# EAGLE design Breakout Board for USB microB (EAGLE 6.4)
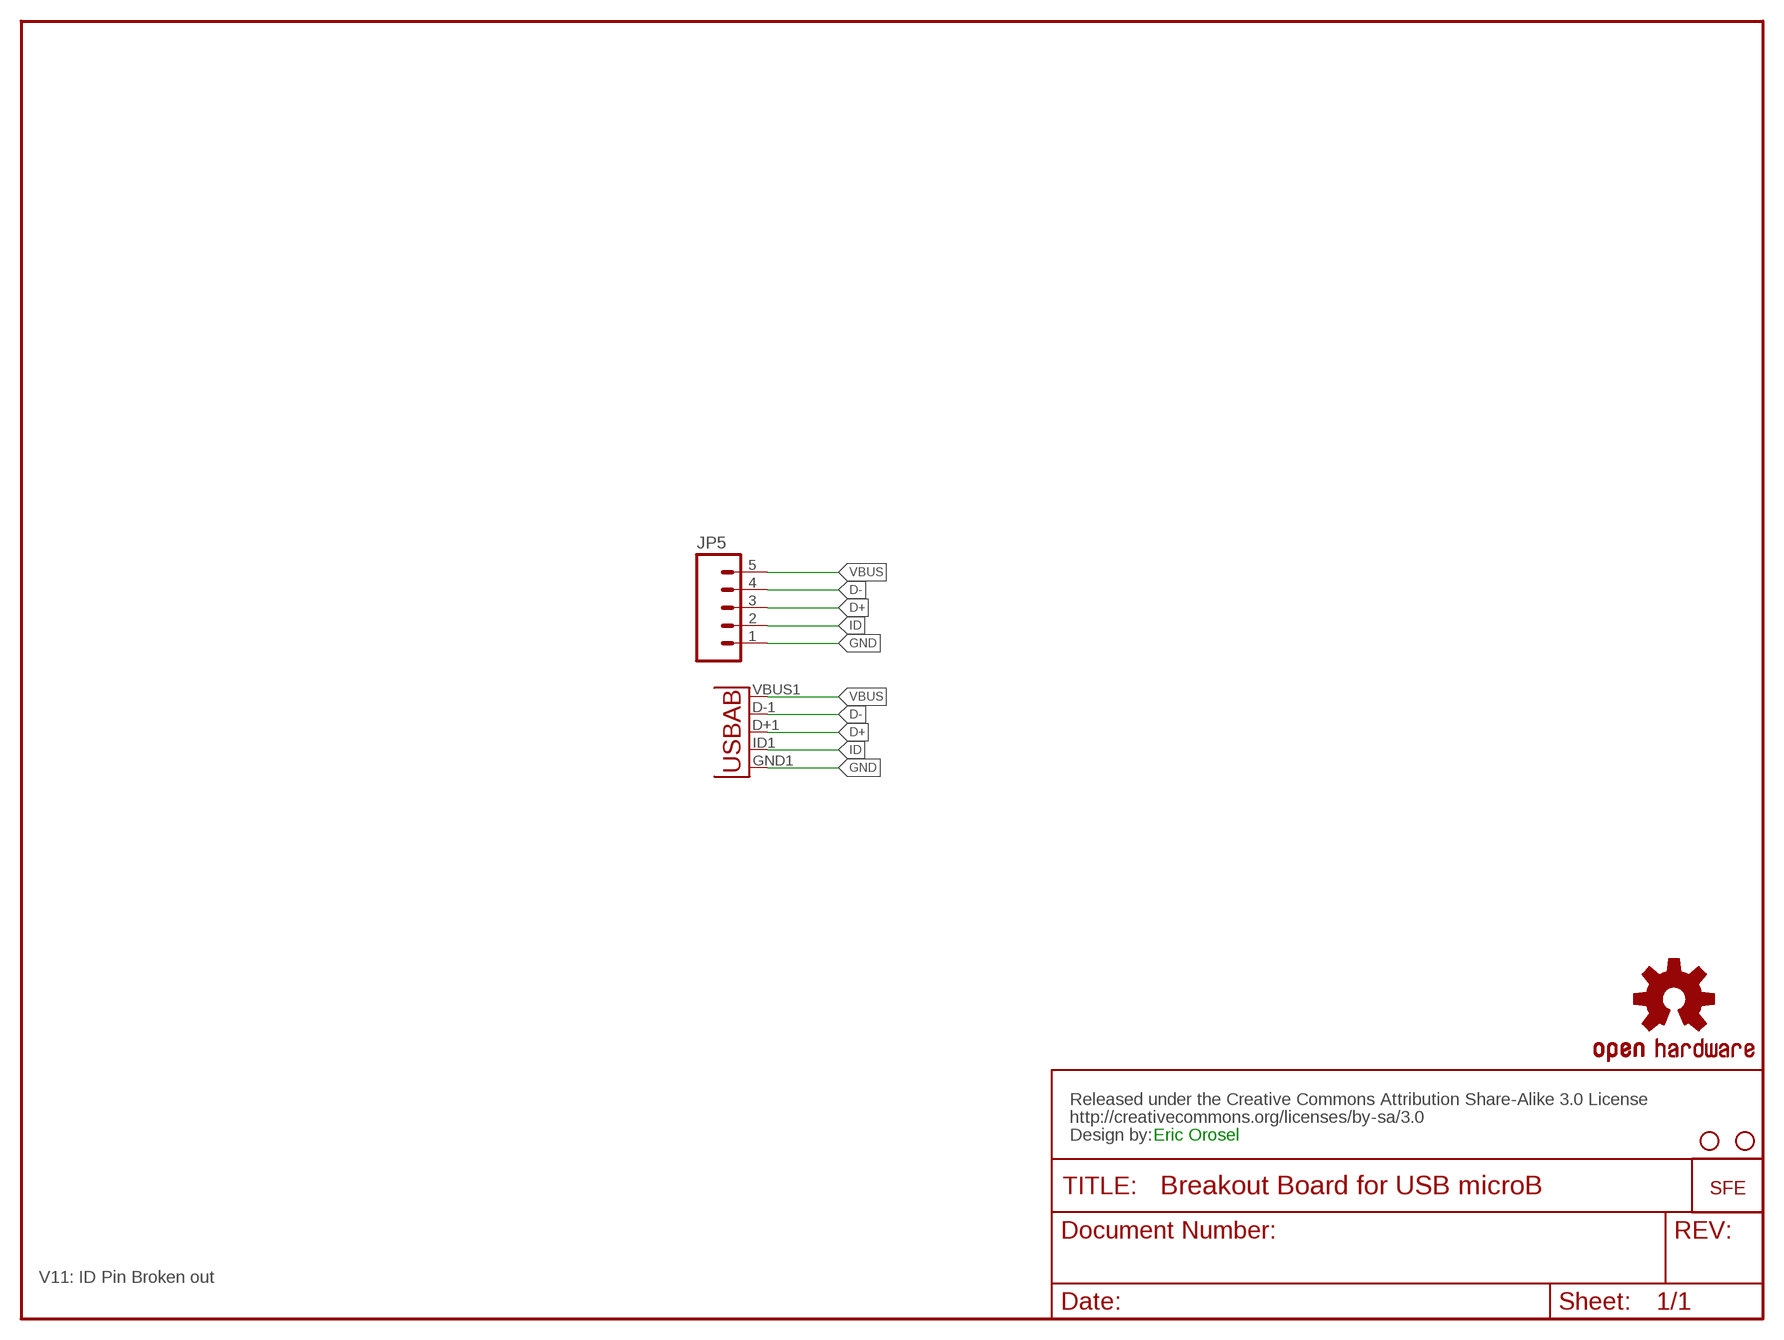
[diagram p0: schematic, sheet 1]

## Parts
JP2  LOGO-SFESK  [SFE-LOGO-FLAME]
JP3  STAND-OFF  [STAND-OFF]
JP4  STAND-OFF  [STAND-OFF]
JP5  M05PTH  [1X05]
U$2  CREATIVE_COMMONS  [CREATIVE_COMMONS]
U$3  OSHW-LOGOS  [OSHW-LOGO-S]
U$4  USB-AB""  [USB-AB-MICRO-SMD_V02_BOSS]

## Nets
D+: JP5.3 U$4.D+1(D+)
D-: JP5.4 U$4.D-1(D-)
GND: JP5.1 U$4.GND1(GND)
ID: JP5.2 U$4.ID1(USBID)
VBUS: JP5.5 U$4.VBUS1(VBUS)

## Notes on the sheet
- Eric Orosel
- V11: ID Pin Broken out

## Library data of the parts
JP2 = SparkFun:LOGO-SFE: Spark Fun Electronics PCB Logo This is the standard Spark Fun Electronics PCB logo.
JP3 JP4 = SparkFun:STAND-OFF: Stand Off This is the mechanical footprint for a #4 phillips button head screw. Use the keepout ring to avoid running the screw head into surrounding components. SKU : PRT-00447
JP5 = SparkFun:M05: Header 5 Standard 5-pin 0.1" header. Use with straight break away headers (SKU : PRT-00116), right angle break away headers (PRT-00553), swiss pins (PRT-00743), machine pins (PRT-00117), and female headers (PRT-00115). Molex polarized connector foot print use with SKU : PRT-08230 with associated crimp pins and housings.
U$2 = SparkFun-Aesthetics:CREATIVE_COMMONS: Creative Commons License summary
U$3 = SparkFun-Aesthetics:OSHW-LOGO: Open Source Hardware Logo This logo indicates the piece of hardware it is found on incorporates a OSHW license and/or adheres to the definition of open source hardware found here: http://freedomdefined.org/OSHW
U$4 = Testing:USB-AB: This is a USB AB connector that is compatible with USB OTG. i.e. this connector can serve as a host or device

## Board
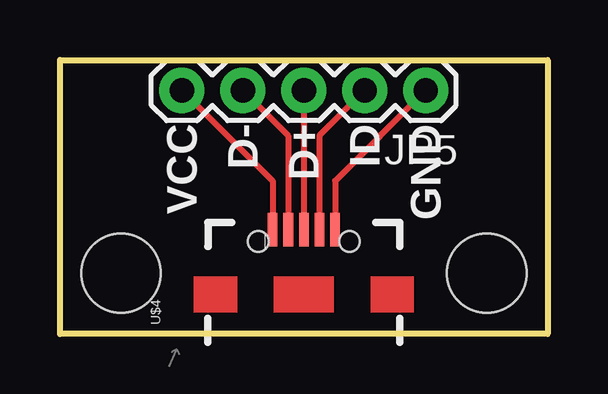
[diagram p1: board, top side]
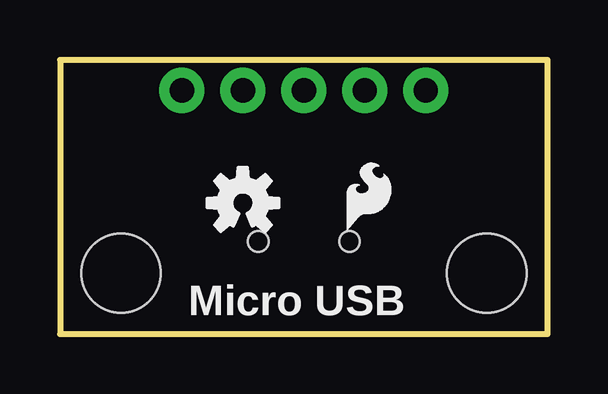
[diagram p2: board, bottom side, seen from below]

Size 20.32 x 11.43 mm. Coordinates in mm from the lower left corner, seen from the top.
Outline: 0,0 0,11.43 20.32,11.43 20.32,0 0,0
Copper layers (1*16): Top 0.035mm / dielectric 1.5mm / Bottom 0.035mm
Design rules "default": minimum track width 8mil, minimum drill 20mil, track to track 8mil, track to pad 8mil, pad to pad 8mil, via to via 8mil, smd to smd 8mil, copper to edge 9mil, drill to drill 8mil, minimum pad ring 12mil, minimum via ring 10mil, stop-mask expansion 4mil, vias tented up to drill 20mil, thermal gap 10mil

### Footprints (pad centres in the part's own frame; a part is rotated, then mirrored left to right if it is on the bottom)
STAND-OFF = hole 3.302: 0,0
1X05 = drill 1.016 pad 1.88: 1 0,0; 2 2.54,0; 3 5.08,0; 4 7.62,0; 5 10.16,0
USB-AB-MICRO-SMD_V02_BOSS = smd 1.4 x 0.4: D+1 2.7,0; D-1 2.7,0.65; GND1 2.7,-1.3; ID1 2.7,-0.65; VBUS1 2.7,1.3 | hole 0.85: 2.2,1.9; 2.2,-1.9

### Placement (x,y rotation side)
JP2  8.38,4.32 0 bottom
JP3  17.78,2.54 0 top
JP4  2.54,2.54 0 top
JP5  15.24,10.16 180 top
U$2  21.59,-8.89 0 top  (outside the outline)
U$3  12.7,5.46 0 bottom
U$4  10.16,1.65 90 top

### Tracks (layer width: path | path; a pad name or v marks a point on that pad's centre or on a via)
D+
  Top 0.254: JP5.3 U$4.D+1
D-
  Top 0.254: JP5.4 9.51,8.27 U$4.D-1
GND
  Top 0.254: JP5.1 11.46,6.38 U$4.GND1
ID
  Top 0.254: JP5.2 10.81,8.27 U$4.ID1
VBUS
  Top 0.254: JP5.5 8.86,6.38 U$4.VBUS1

### Text on the board
tPlace: VCC | D- | D+ | ID | GND
bPlace: Micro USB